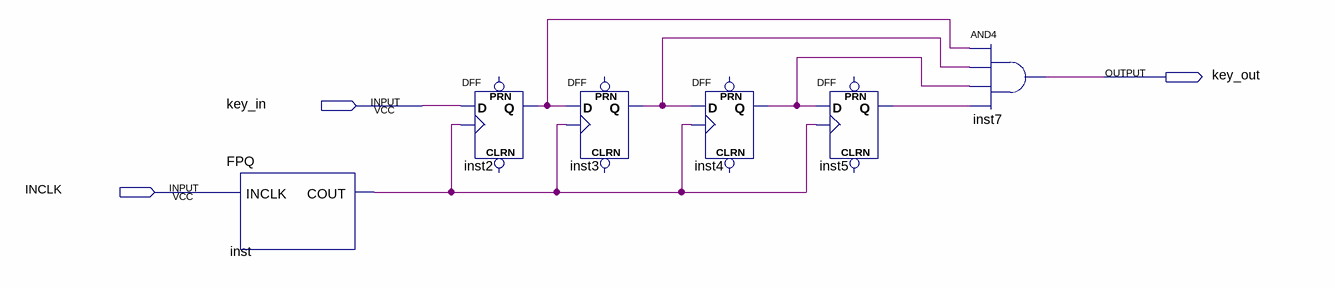
[diagram p0: schematic sheet]
// Quartus schematic QD.bdf as structural Verilog: 6 symbols, 3 pins
module QD (
  input  key_in,
  input  INCLK,
  output key_out
);

  wire inst2_q, inst3_q, inst4_q, inst5_q, inst_cout;

  FPQ inst (.INCLK(INCLK), .COUT(inst_cout));
  DFF inst2 (.CLK(inst_cout), .D(key_in), .Q(inst2_q));  // open: CLRN, PRN
  DFF inst3 (.CLK(inst_cout), .D(inst2_q), .Q(inst3_q));  // open: CLRN, PRN
  DFF inst4 (.CLK(inst_cout), .D(inst3_q), .Q(inst4_q));  // open: CLRN, PRN
  DFF inst5 (.CLK(inst_cout), .D(inst4_q), .Q(inst5_q));  // open: CLRN, PRN
  and inst7 (key_out, inst2_q, inst3_q, inst4_q, inst5_q);
endmodule
